# EAGLE design IRSensorModule (EAGLE 7.3.0)
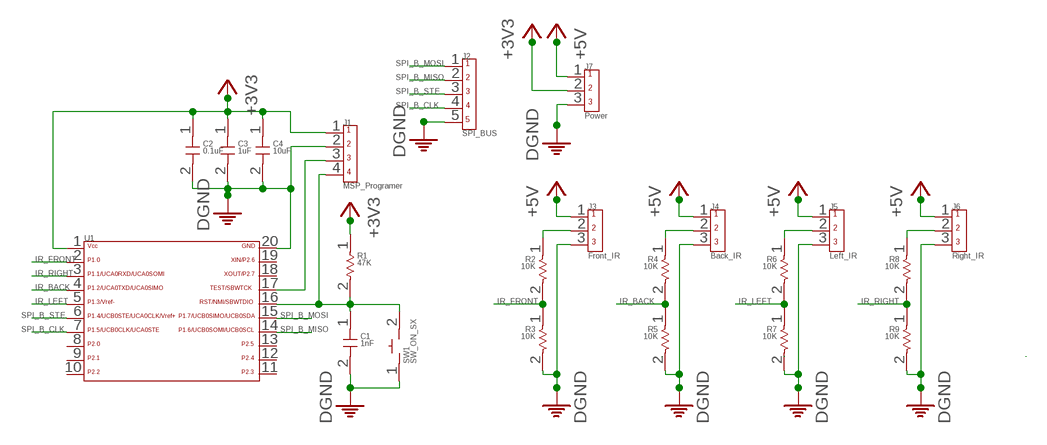
[diagram p0: schematic, sheet 1]

## Parts
C1  1nF  CAPACITOR_FIXED_0805  [0805]
C2  0.1uF  CAPACITOR_FIXED_0805  [0805]
C3  1uF  CAPACITOR_FIXED_0805  [0805]
C4  10uF  CAPACITOR_FIXED_0805  [0805]
J1  MSP_Programer  CON_HEADER_4PIN_100  [CON_HEADER_4_100]
J2  SPI_BUS  CON_HEADER_5PIN_100  [CON_HEADER_5_100]
J3  Front_IR  CON_HEADER_3PIN_100  [CON_HEADER_3_100]
J4  Back_IR  CON_HEADER_3PIN_100  [CON_HEADER_3_100]
J5  Left_IR  CON_HEADER_3PIN_100  [CON_HEADER_3_100]
J6  Right_IR  CON_HEADER_3PIN_100  [CON_HEADER_3_100]
J7  Power  CON_HEADER_3PIN_100  [CON_HEADER_3_100]
R1  47K  RESISTOR_0805  [0805]
R2  10K  RESISTOR_0805  [0805]
R3  10K  RESISTOR_0805  [0805]
R4  10K  RESISTOR_0805  [0805]
R5  10K  RESISTOR_0805  [0805]
R6  10K  RESISTOR_0805  [0805]
R7  10K  RESISTOR_0805  [0805]
R8  10K  RESISTOR_0805  [0805]
R9  10K  RESISTOR_0805  [0805]
SW1  SW_ON_SX  [SW_S]
U1  MSP430G2X53/G2X13_20PIN  [SSOP-20]

## Nets
+3V3: C2.1 C3.1 C4.1 J1.1 J7.2 R1.1 U1.1
+5V: J3.1 J4.1 J5.1 J6.1 J7.1
DGND: C1.2 C2.2 C3.2 C4.2 J1.2 J2.5 J3.3 J4.3 J5.3 J6.3 J7.3 R3.2 R5.2 R7.2 R9.2 SW1.1 U1.20
IR_BACK: R4.2 R5.1 U1.4
IR_FRONT: R2.2 R3.1 U1.2
IR_LEFT: R6.2 R7.1 U1.5
IR_RIGHT: R8.2 R9.1 U1.3
MSP430REST: C1.1 J1.4 R1.2 SW1.2 U1.16
N$1: J1.3 U1.17
N$3: J3.2 R2.1
N$5: J4.2 R4.1
N$7: J5.2 R6.1
N$9: J6.2 R8.1
SPI_B_CLK: J2.4 U1.7
SPI_B_MISO: J2.2 U1.14
SPI_B_MOSI: J2.1 U1.15
SPI_B_STE: J2.3 U1.6
Unconnected: U1.8 U1.9 U1.10 U1.11 U1.12 U1.13 U1.18 U1.19

## Library data of the parts
C1-C4 = ivani_lib:CAPACITOR_FIXED
J1 = ivani_lib:CON_HEADER_4PIN
J2 = ivani_lib:CON_HEADER_5PIN
J3-J7 = ivani_lib:CON_HEADER_3PIN
R1-R9 = ivani_lib:RESISTOR
SW1 = robot_lib:SW_ON
U1 = ivani_lib:MSP430G2X53/G2X13

## Board
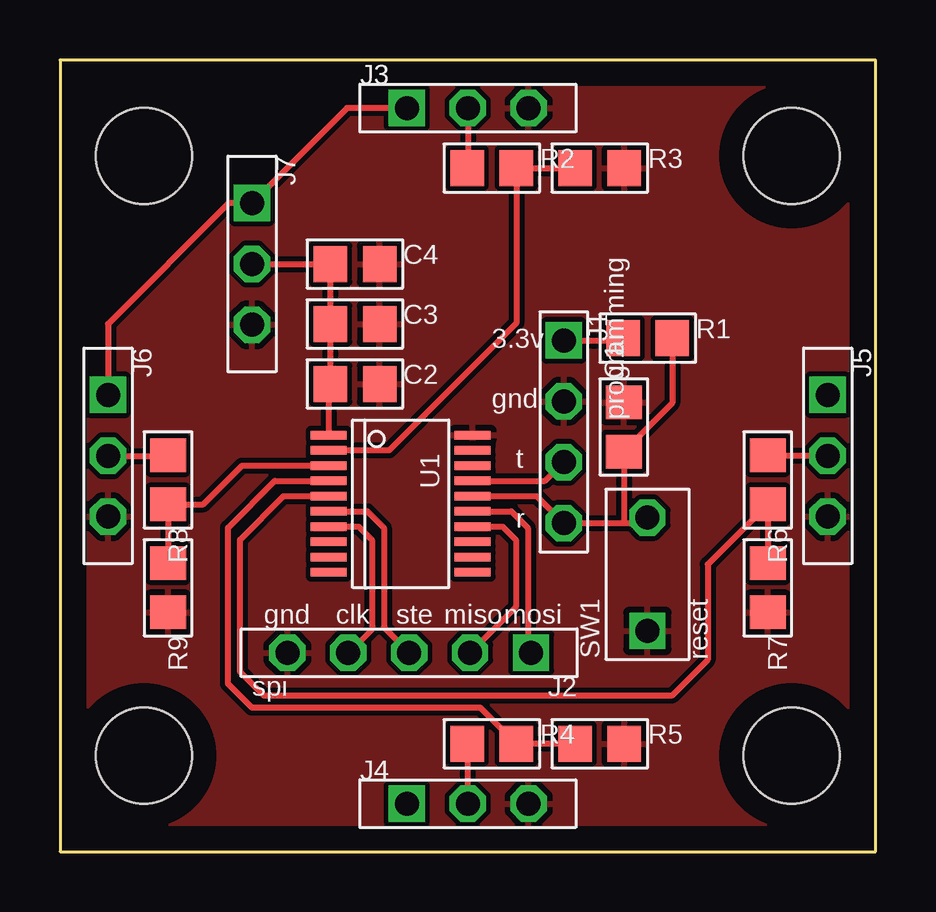
[diagram p1: board, top side]
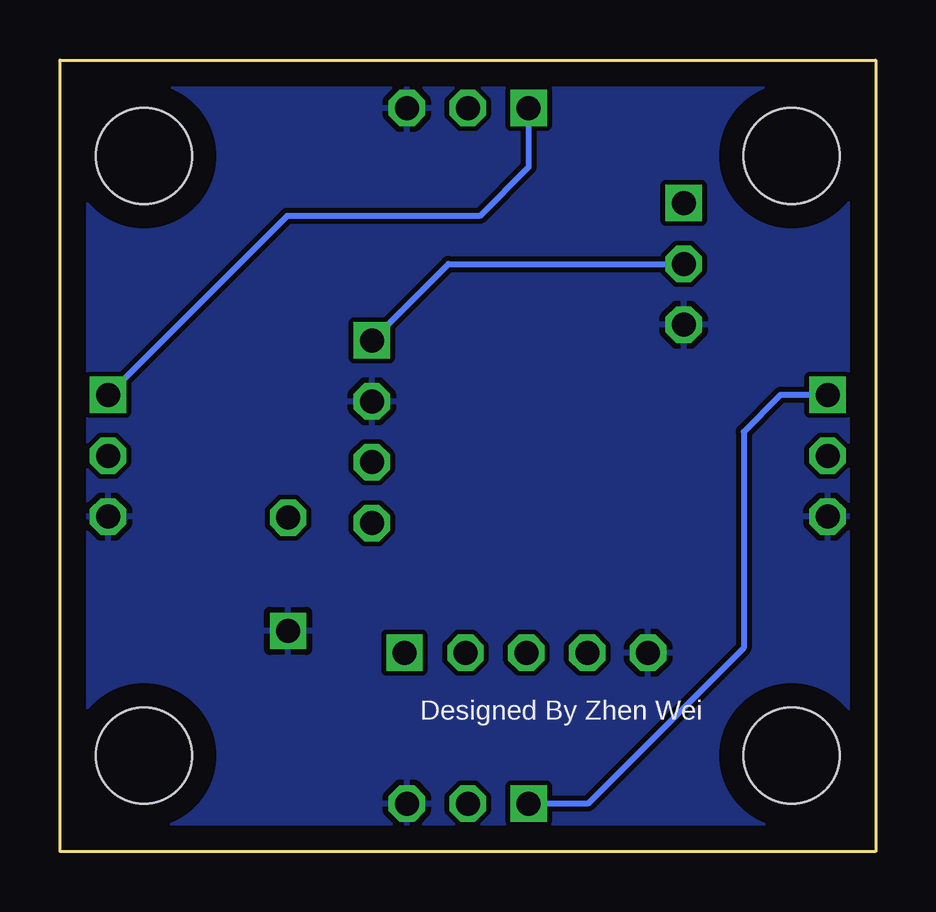
[diagram p2: board, bottom side, seen from below]

Size 34 x 33 mm. Coordinates in mm from the lower left corner, seen from the top.
Outline: 0,0 34,0 34,33 0,33 0,0
Copper layers (1*16): Top 0.035mm / dielectric 1.5mm / Bottom 0.035mm
Design rules "default": minimum track width 10mil, minimum drill 24mil, track to track 8mil, track to pad 8mil, pad to pad 8mil, via to via 8mil, smd to smd 8mil, copper to edge 40mil, drill to drill 8mil, minimum pad ring 10mil, minimum via ring 8mil, stop-mask expansion 4mil, vias tented up to drill 0mil, thermal gap 10mil
Holes 4 mm at 3.5,29 30.5,29 3.5,4 30.5,4

### Footprints (pad centres in the part's own frame; a part is rotated, then mirrored left to right if it is on the bottom)
0805 = smd 1.4 x 1.5: 1 -1.025,0; 2 1.025,0
CON_HEADER_4_100 = drill 1 square: 1 -3.81,0 | drill 1 octagon: 2 -1.27,0; 3 1.27,0; 4 3.81,0
CON_HEADER_5_100 = drill 1 square: 1 -5.08,0 | drill 1 octagon: 2 -2.54,0; 3 0,0; 4 2.54,0; 5 5.08,0
CON_HEADER_3_100 = drill 1 square: 1 -2.54,0 | drill 1 octagon: 2 0,0; 3 2.54,0
SW_S = drill 1 square: 1 -2.36,0 | drill 1 octagon: 2 2.36,0
SSOP-20 = smd 0.35 x 1.5: 1 -2.857,-3; 2 -2.223,-3; 3 -1.587,-3; 4 -0.953,-3; 5 -0.318,-3; 6 0.318,-3; 7 0.953,-3; 8 1.587,-3; 9 2.223,-3; 10 2.857,-3; 11 2.857,3; 12 2.223,3; 13 1.587,3; 14 0.953,3; 15 0.318,3; 16 -0.318,3; 17 -0.953,3; 18 -1.587,3; 19 -2.223,3; 20 -2.857,3

### Placement (x,y rotation side)
C1  23.5,17.7 90 top
C2  12.3,19.5 0 top
C3  12.3,22 0 top
C4  12.3,24.5 0 top
J1  21,17.5 270 top
J2  14.56,8.29 180 top
J3  17,31 0 top
J4  17,2 0 top
J5  32,16.5 270 top
J6  2,16.5 270 top
J7  8,24.5 270 top
R1  24.5,21.4 0 top
R2  18,28.5 0 top
R3  22.5,28.5 0 top
R4  18,4.5 0 top
R5  22.5,4.5 0 top
R6  29.5,15.5 270 top
R7  29.5,11 270 top
R8  4.5,15.5 270 top
R9  4.5,11 270 top
SW1  24.49,11.56 90 top
U1  14.2,14.5 270 top

### Tracks (layer width: path | path; a pad name or v marks a point on that pad's centre or on a via)
+3V3
  Top 0.254: U1.1 11.2,19.5 C2.1 C3.1 C4.1 J7.2 | J1.1 23.39,21.31 R1.1
  Bottom 0.254: J1.1 17.81,24.5 J7.2
+5V
  Top 0.254: J3.1 11.96,31 J7.1 7.04,27.04 2,22 J6.1
  Bottom 0.254: J6.1 3.96,19.04 5.5,17.5 5.5,8.5 12,2 J4.1 | J3.1 14.46,28.54 16.5,26.5 24.54,26.5 J5.1
DGND
  pour Bottom: 0.5,32.5 33.5,32.5 33.5,0.5 0.5,0.5
  pour Top: 0.5,32.5 33.5,32.5 33.5,0.5 0.5,0.5
IR_BACK
  Top 0.254: R5.1 R4.2 17.52,6 8,6 7,7 7,13.5 8.95,15.45 U1.4
IR_FRONT
  Top 0.254: 22,28.5 R3.1 R2.2 19.02,22.02 13.72,16.72 U1.2
IR_LEFT
  Top 0.254: R7.1 R6.2 27,11.97 27,8 25.5,6.5 8.5,6.5 7.5,7.5 7.5,13 9.32,14.82 U1.5
IR_RIGHT
  Top 0.254: R9.1 R8.2 5.97,14.47 7.59,16.09 U1.3
MSP430REST
  Top 0.254: U1.16 19.87,14.82 J1.4 23.5,13.69 | R1.2 25.52,18.7 C1.1 23.5,13.69 | 23.5,13.69 24.26,13.69 SW1.2
N$1
  Top 0.254: U1.17 20.22,15.45 J1.3
N$3
  Top 0.254: J3.2 17,28.52 R2.1
N$5
  Top 0.254: J4.2 17,4.47 R4.1
N$7
  Top 0.254: J5.2 29.52,16.5 R6.1
N$9
  Top 0.254: J6.2 4.47,16.5 R8.1
SPI_B_CLK
  Top 0.254: U1.7 12.45,13.55 13,13 13,9.27 J2.4
SPI_B_MISO
  Top 0.254: U1.14 18.45,13.55 19,13 19,10.19 J2.2
SPI_B_MOSI
  Top 0.254: U1.15 18.82,14.18 19.5,13.5 19.5,8.43 J2.1
SPI_B_STE
  Top 0.254: U1.6 12.82,14.18 13.5,13.5 13.5,9.35 J2.3

### Text on the board
tPlace: 3.3v | gnd | programming | t | r | gnd | clk | ste | miso | mosi | reset | spi
bPlace: Designed By Zhen Wei